# Vivado block design bd_48ac, xczu19eg-ffvc1760-2-i, Vivado 2021.1
# (continued, part 2 of 4)
current_bd_instance /s01_nodes

# ---- hierarchy /m00_nodes ----
current_bd_instance /m00_nodes
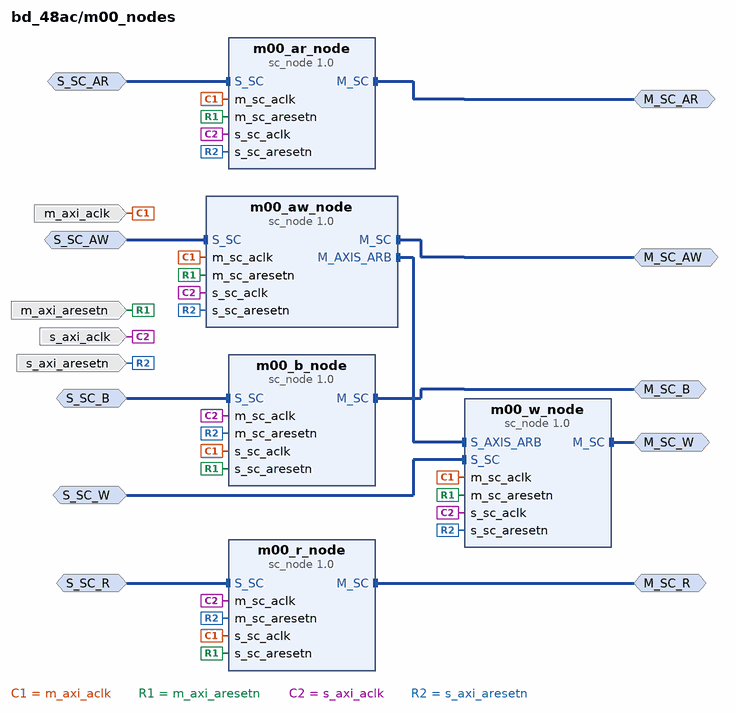
[diagram p7: block diagram inside /m00_nodes]
create_bd_intf_pin -mode Master -vlnv xilinx.com:interface:sc_rtl:1.0 M_SC_AR
create_bd_intf_pin -mode Slave -vlnv xilinx.com:interface:sc_rtl:1.0 S_SC_AR
create_bd_intf_pin -mode Master -vlnv xilinx.com:interface:sc_rtl:1.0 M_SC_R
create_bd_intf_pin -mode Slave -vlnv xilinx.com:interface:sc_rtl:1.0 S_SC_R
create_bd_intf_pin -mode Master -vlnv xilinx.com:interface:sc_rtl:1.0 M_SC_AW
create_bd_intf_pin -mode Slave -vlnv xilinx.com:interface:sc_rtl:1.0 S_SC_AW
create_bd_intf_pin -mode Master -vlnv xilinx.com:interface:sc_rtl:1.0 M_SC_W
create_bd_intf_pin -mode Slave -vlnv xilinx.com:interface:sc_rtl:1.0 S_SC_W
create_bd_intf_pin -mode Master -vlnv xilinx.com:interface:sc_rtl:1.0 M_SC_B
create_bd_intf_pin -mode Slave -vlnv xilinx.com:interface:sc_rtl:1.0 S_SC_B
create_bd_pin -dir I -type clk s_axi_aclk
create_bd_pin -dir I -type rst s_axi_aresetn
create_bd_pin -dir I -type clk m_axi_aclk
create_bd_pin -dir I -type rst m_axi_aresetn

create_bd_cell -type ip -vlnv xilinx.com:ip:sc_node:1.0 m00_ar_node
set_property -dict [list \
  CONFIG.ACLK_RELATIONSHIP 1 \
  CONFIG.ADDR_WIDTH 64 \
  CONFIG.CHANNEL 2 \
  CONFIG.ID_WIDTH 2 \
  CONFIG.M00_NUM_BYTES 64 \
  CONFIG.M01_NUM_BYTES 64 \
  CONFIG.M02_NUM_BYTES 64 \
  CONFIG.M03_NUM_BYTES 64 \
  CONFIG.M04_NUM_BYTES 64 \
  CONFIG.M05_NUM_BYTES 64 \
  CONFIG.M06_NUM_BYTES 64 \
  CONFIG.M07_NUM_BYTES 64 \
  CONFIG.M08_NUM_BYTES 64 \
  CONFIG.M09_NUM_BYTES 64 \
  CONFIG.M10_NUM_BYTES 64 \
  CONFIG.M11_NUM_BYTES 64 \
  CONFIG.M12_NUM_BYTES 64 \
  CONFIG.M13_NUM_BYTES 64 \
  CONFIG.M14_NUM_BYTES 64 \
  CONFIG.M15_NUM_BYTES 64 \
  CONFIG.MAX_PAYLD_BYTES 64 \
  CONFIG.M_SEND_PIPELINE 0 \
  CONFIG.NUM_MI 1 \
  CONFIG.NUM_OUTSTANDING 8 \
  CONFIG.NUM_SI 2 \
  CONFIG.PAYLD_WIDTH 178 \
  CONFIG.S00_NUM_BYTES 64 \
  CONFIG.S01_NUM_BYTES 64 \
  CONFIG.S02_NUM_BYTES 64 \
  CONFIG.S03_NUM_BYTES 64 \
  CONFIG.S04_NUM_BYTES 64 \
  CONFIG.S05_NUM_BYTES 64 \
  CONFIG.S06_NUM_BYTES 64 \
  CONFIG.S07_NUM_BYTES 64 \
  CONFIG.S08_NUM_BYTES 64 \
  CONFIG.S09_NUM_BYTES 64 \
  CONFIG.S10_NUM_BYTES 64 \
  CONFIG.S11_NUM_BYTES 64 \
  CONFIG.S12_NUM_BYTES 64 \
  CONFIG.S13_NUM_BYTES 64 \
  CONFIG.S14_NUM_BYTES 64 \
  CONFIG.S15_NUM_BYTES 64 \
  CONFIG.SC_ROUTE_WIDTH 7 \
  CONFIG.S_LATENCY 1 \
  CONFIG.USER_WIDTH 0 \
] [get_bd_cells m00_ar_node]
create_bd_cell -type ip -vlnv xilinx.com:ip:sc_node:1.0 m00_r_node
set_property -dict [list \
  CONFIG.ACLK_RELATIONSHIP 1 \
  CONFIG.ADDR_WIDTH 64 \
  CONFIG.CHANNEL 0 \
  CONFIG.ID_WIDTH 2 \
  CONFIG.M00_NUM_BYTES 64 \
  CONFIG.M01_NUM_BYTES 64 \
  CONFIG.M02_NUM_BYTES 64 \
  CONFIG.M03_NUM_BYTES 64 \
  CONFIG.M04_NUM_BYTES 64 \
  CONFIG.M05_NUM_BYTES 64 \
  CONFIG.M06_NUM_BYTES 64 \
  CONFIG.M07_NUM_BYTES 64 \
  CONFIG.M08_NUM_BYTES 64 \
  CONFIG.M09_NUM_BYTES 64 \
  CONFIG.M10_NUM_BYTES 64 \
  CONFIG.M11_NUM_BYTES 64 \
  CONFIG.M12_NUM_BYTES 64 \
  CONFIG.M13_NUM_BYTES 64 \
  CONFIG.M14_NUM_BYTES 64 \
  CONFIG.M15_NUM_BYTES 64 \
  CONFIG.MAX_PAYLD_BYTES 64 \
  CONFIG.M_PIPELINE 0 \
  CONFIG.NUM_MI 2 \
  CONFIG.NUM_OUTSTANDING 8 \
  CONFIG.NUM_SI 1 \
  CONFIG.PAYLD_WIDTH 533 \
  CONFIG.S00_NUM_BYTES 64 \
  CONFIG.S01_NUM_BYTES 64 \
  CONFIG.S02_NUM_BYTES 64 \
  CONFIG.S03_NUM_BYTES 64 \
  CONFIG.S04_NUM_BYTES 64 \
  CONFIG.S05_NUM_BYTES 64 \
  CONFIG.S06_NUM_BYTES 64 \
  CONFIG.S07_NUM_BYTES 64 \
  CONFIG.S08_NUM_BYTES 64 \
  CONFIG.S09_NUM_BYTES 64 \
  CONFIG.S10_NUM_BYTES 64 \
  CONFIG.S11_NUM_BYTES 64 \
  CONFIG.S12_NUM_BYTES 64 \
  CONFIG.S13_NUM_BYTES 64 \
  CONFIG.S14_NUM_BYTES 64 \
  CONFIG.S15_NUM_BYTES 64 \
  CONFIG.SC_ROUTE_WIDTH 2 \
  CONFIG.USER_BITS_PER_BYTE 0 \
  CONFIG.USER_WIDTH 0 \
] [get_bd_cells m00_r_node]
create_bd_cell -type ip -vlnv xilinx.com:ip:sc_node:1.0 m00_aw_node
set_property -dict [list \
  CONFIG.ACLK_RELATIONSHIP 1 \
  CONFIG.ADDR_WIDTH 64 \
  CONFIG.CHANNEL 3 \
  CONFIG.ID_WIDTH 2 \
  CONFIG.M00_NUM_BYTES 64 \
  CONFIG.M01_NUM_BYTES 64 \
  CONFIG.M02_NUM_BYTES 64 \
  CONFIG.M03_NUM_BYTES 64 \
  CONFIG.M04_NUM_BYTES 64 \
  CONFIG.M05_NUM_BYTES 64 \
  CONFIG.M06_NUM_BYTES 64 \
  CONFIG.M07_NUM_BYTES 64 \
  CONFIG.M08_NUM_BYTES 64 \
  CONFIG.M09_NUM_BYTES 64 \
  CONFIG.M10_NUM_BYTES 64 \
  CONFIG.M11_NUM_BYTES 64 \
  CONFIG.M12_NUM_BYTES 64 \
  CONFIG.M13_NUM_BYTES 64 \
  CONFIG.M14_NUM_BYTES 64 \
  CONFIG.M15_NUM_BYTES 64 \
  CONFIG.MAX_PAYLD_BYTES 64 \
  CONFIG.M_SEND_PIPELINE 0 \
  CONFIG.NUM_MI 1 \
  CONFIG.NUM_OUTSTANDING 32 \
  CONFIG.NUM_SI 2 \
  CONFIG.PAYLD_WIDTH 178 \
  CONFIG.S00_NUM_BYTES 64 \
  CONFIG.S01_NUM_BYTES 64 \
  CONFIG.S02_NUM_BYTES 64 \
  CONFIG.S03_NUM_BYTES 64 \
  CONFIG.S04_NUM_BYTES 64 \
  CONFIG.S05_NUM_BYTES 64 \
  CONFIG.S06_NUM_BYTES 64 \
  CONFIG.S07_NUM_BYTES 64 \
  CONFIG.S08_NUM_BYTES 64 \
  CONFIG.S09_NUM_BYTES 64 \
  CONFIG.S10_NUM_BYTES 64 \
  CONFIG.S11_NUM_BYTES 64 \
  CONFIG.S12_NUM_BYTES 64 \
  CONFIG.S13_NUM_BYTES 64 \
  CONFIG.S14_NUM_BYTES 64 \
  CONFIG.S15_NUM_BYTES 64 \
  CONFIG.SC_ROUTE_WIDTH 7 \
  CONFIG.S_LATENCY 1 \
  CONFIG.USER_WIDTH 0 \
] [get_bd_cells m00_aw_node]
create_bd_cell -type ip -vlnv xilinx.com:ip:sc_node:1.0 m00_w_node
set_property -dict [list \
  CONFIG.ACLK_RELATIONSHIP 1 \
  CONFIG.ADDR_WIDTH 64 \
  CONFIG.CHANNEL 1 \
  CONFIG.ID_WIDTH 2 \
  CONFIG.M00_NUM_BYTES 64 \
  CONFIG.M01_NUM_BYTES 64 \
  CONFIG.M02_NUM_BYTES 64 \
  CONFIG.M03_NUM_BYTES 64 \
  CONFIG.M04_NUM_BYTES 64 \
  CONFIG.M05_NUM_BYTES 64 \
  CONFIG.M06_NUM_BYTES 64 \
  CONFIG.M07_NUM_BYTES 64 \
  CONFIG.M08_NUM_BYTES 64 \
  CONFIG.M09_NUM_BYTES 64 \
  CONFIG.M10_NUM_BYTES 64 \
  CONFIG.M11_NUM_BYTES 64 \
  CONFIG.M12_NUM_BYTES 64 \
  CONFIG.M13_NUM_BYTES 64 \
  CONFIG.M14_NUM_BYTES 64 \
  CONFIG.M15_NUM_BYTES 64 \
  CONFIG.MAX_PAYLD_BYTES 64 \
  CONFIG.M_SEND_PIPELINE 0 \
  CONFIG.NUM_MI 1 \
  CONFIG.NUM_OUTSTANDING 32 \
  CONFIG.NUM_SI 2 \
  CONFIG.PAYLD_WIDTH 598 \
  CONFIG.S00_NUM_BYTES 64 \
  CONFIG.S01_NUM_BYTES 64 \
  CONFIG.S02_NUM_BYTES 64 \
  CONFIG.S03_NUM_BYTES 64 \
  CONFIG.S04_NUM_BYTES 64 \
  CONFIG.S05_NUM_BYTES 64 \
  CONFIG.S06_NUM_BYTES 64 \
  CONFIG.S07_NUM_BYTES 64 \
  CONFIG.S08_NUM_BYTES 64 \
  CONFIG.S09_NUM_BYTES 64 \
  CONFIG.S10_NUM_BYTES 64 \
  CONFIG.S11_NUM_BYTES 64 \
  CONFIG.S12_NUM_BYTES 64 \
  CONFIG.S13_NUM_BYTES 64 \
  CONFIG.S14_NUM_BYTES 64 \
  CONFIG.S15_NUM_BYTES 64 \
  CONFIG.SC_ROUTE_WIDTH 7 \
  CONFIG.S_LATENCY 1 \
  CONFIG.USER_BITS_PER_BYTE 0 \
  CONFIG.USER_WIDTH 0 \
] [get_bd_cells m00_w_node]
create_bd_cell -type ip -vlnv xilinx.com:ip:sc_node:1.0 m00_b_node
set_property -dict [list \
  CONFIG.ACLK_RELATIONSHIP 1 \
  CONFIG.ADDR_WIDTH 64 \
  CONFIG.CHANNEL 4 \
  CONFIG.ID_WIDTH 2 \
  CONFIG.M00_NUM_BYTES 64 \
  CONFIG.M01_NUM_BYTES 64 \
  CONFIG.M02_NUM_BYTES 64 \
  CONFIG.M03_NUM_BYTES 64 \
  CONFIG.M04_NUM_BYTES 64 \
  CONFIG.M05_NUM_BYTES 64 \
  CONFIG.M06_NUM_BYTES 64 \
  CONFIG.M07_NUM_BYTES 64 \
  CONFIG.M08_NUM_BYTES 64 \
  CONFIG.M09_NUM_BYTES 64 \
  CONFIG.M10_NUM_BYTES 64 \
  CONFIG.M11_NUM_BYTES 64 \
  CONFIG.M12_NUM_BYTES 64 \
  CONFIG.M13_NUM_BYTES 64 \
  CONFIG.M14_NUM_BYTES 64 \
  CONFIG.M15_NUM_BYTES 64 \
  CONFIG.MAX_PAYLD_BYTES 64 \
  CONFIG.M_PIPELINE 0 \
  CONFIG.NUM_MI 2 \
  CONFIG.NUM_OUTSTANDING 32 \
  CONFIG.NUM_SI 1 \
  CONFIG.PAYLD_WIDTH 7 \
  CONFIG.S00_NUM_BYTES 64 \
  CONFIG.S01_NUM_BYTES 64 \
  CONFIG.S02_NUM_BYTES 64 \
  CONFIG.S03_NUM_BYTES 64 \
  CONFIG.S04_NUM_BYTES 64 \
  CONFIG.S05_NUM_BYTES 64 \
  CONFIG.S06_NUM_BYTES 64 \
  CONFIG.S07_NUM_BYTES 64 \
  CONFIG.S08_NUM_BYTES 64 \
  CONFIG.S09_NUM_BYTES 64 \
  CONFIG.S10_NUM_BYTES 64 \
  CONFIG.S11_NUM_BYTES 64 \
  CONFIG.S12_NUM_BYTES 64 \
  CONFIG.S13_NUM_BYTES 64 \
  CONFIG.S14_NUM_BYTES 64 \
  CONFIG.S15_NUM_BYTES 64 \
  CONFIG.SC_ROUTE_WIDTH 2 \
  CONFIG.USER_WIDTH 0 \
] [get_bd_cells m00_b_node]

# ---- hierarchy /m00_exit_pipeline ----
current_bd_instance /m00_exit_pipeline
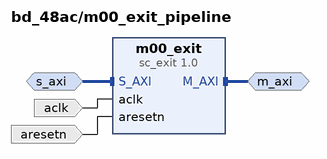
[diagram p8: block diagram inside /m00_exit_pipeline]
create_bd_intf_pin -mode Slave -vlnv xilinx.com:interface:aximm_rtl:1.0 s_axi
create_bd_intf_pin -mode Master -vlnv xilinx.com:interface:aximm_rtl:1.0 m_axi
create_bd_pin -dir I -type clk aclk
create_bd_pin -dir I -type rst aresetn

create_bd_cell -type ip -vlnv xilinx.com:ip:sc_exit:1.0 m00_exit
set_property -dict [list \
  CONFIG.ADDR_WIDTH 34 \
  CONFIG.HAS_BURST 1 \
  CONFIG.HAS_LOCK 0 \
  CONFIG.IS_CASCADED 0 \
  CONFIG.MAX_RUSER_BITS_PER_BYTE 0 \
  CONFIG.MAX_WUSER_BITS_PER_BYTE 0 \
  CONFIG.MEP_IDENTIFIER_WIDTH 2 \
  CONFIG.M_ARUSER_WIDTH 0 \
  CONFIG.M_AWUSER_WIDTH 0 \
  CONFIG.M_BUSER_WIDTH 0 \
  CONFIG.M_ID_WIDTH 0 \
  CONFIG.M_MAX_BURST_LENGTH 256 \
  CONFIG.M_PROTOCOL AXI4 \
  CONFIG.M_RUSER_BITS_PER_BYTE 0 \
  CONFIG.M_RUSER_WIDTH 0 \
  CONFIG.M_WUSER_BITS_PER_BYTE 0 \
  CONFIG.M_WUSER_WIDTH 0 \
  CONFIG.NUM_MSC 7 \
  CONFIG.NUM_READ_OUTSTANDING 8 \
  CONFIG.NUM_WRITE_OUTSTANDING 32 \
  CONFIG.RDATA_WIDTH 512 \
  CONFIG.READ_WRITE_MODE READ_WRITE \
  CONFIG.SSC000_ROUTE 0b00 \
  CONFIG.SSC001_ROUTE 0b01 \
  CONFIG.SSC002_ROUTE 0b10 \
  CONFIG.SSC003_ROUTE 0b00 \
  CONFIG.SSC_ROUTE_WIDTH 2 \
  CONFIG.S_ID_WIDTH 2 \
  CONFIG.WDATA_WIDTH 512 \
] [get_bd_cells m00_exit]

# ---- hierarchy /m01_nodes ----
current_bd_instance /m01_nodes
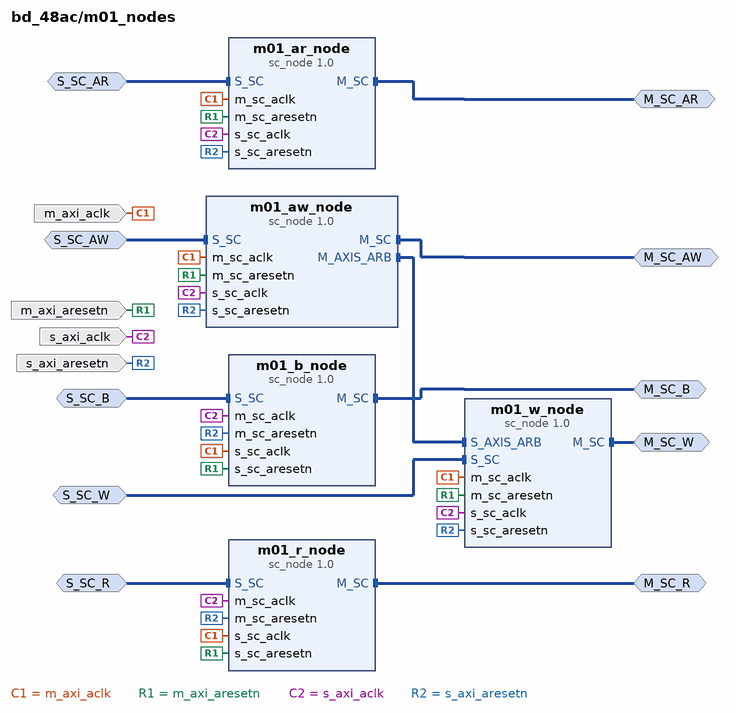
[diagram p9: block diagram inside /m01_nodes]
create_bd_intf_pin -mode Master -vlnv xilinx.com:interface:sc_rtl:1.0 M_SC_AR
create_bd_intf_pin -mode Slave -vlnv xilinx.com:interface:sc_rtl:1.0 S_SC_AR
create_bd_intf_pin -mode Master -vlnv xilinx.com:interface:sc_rtl:1.0 M_SC_R
create_bd_intf_pin -mode Slave -vlnv xilinx.com:interface:sc_rtl:1.0 S_SC_R
create_bd_intf_pin -mode Master -vlnv xilinx.com:interface:sc_rtl:1.0 M_SC_AW
create_bd_intf_pin -mode Slave -vlnv xilinx.com:interface:sc_rtl:1.0 S_SC_AW
create_bd_intf_pin -mode Master -vlnv xilinx.com:interface:sc_rtl:1.0 M_SC_W
create_bd_intf_pin -mode Slave -vlnv xilinx.com:interface:sc_rtl:1.0 S_SC_W
create_bd_intf_pin -mode Master -vlnv xilinx.com:interface:sc_rtl:1.0 M_SC_B
create_bd_intf_pin -mode Slave -vlnv xilinx.com:interface:sc_rtl:1.0 S_SC_B
create_bd_pin -dir I -type clk s_axi_aclk
create_bd_pin -dir I -type rst s_axi_aresetn
create_bd_pin -dir I -type clk m_axi_aclk
create_bd_pin -dir I -type rst m_axi_aresetn

create_bd_cell -type ip -vlnv xilinx.com:ip:sc_node:1.0 m01_ar_node
set_property -dict [list \
  CONFIG.ACLK_RELATIONSHIP 1 \
  CONFIG.ADDR_WIDTH 64 \
  CONFIG.CHANNEL 2 \
  CONFIG.ID_WIDTH 2 \
  CONFIG.M00_NUM_BYTES 4 \
  CONFIG.M01_NUM_BYTES 4 \
  CONFIG.M02_NUM_BYTES 4 \
  CONFIG.M03_NUM_BYTES 4 \
  CONFIG.M04_NUM_BYTES 4 \
  CONFIG.M05_NUM_BYTES 4 \
  CONFIG.M06_NUM_BYTES 4 \
  CONFIG.M07_NUM_BYTES 4 \
  CONFIG.M08_NUM_BYTES 4 \
  CONFIG.M09_NUM_BYTES 4 \
  CONFIG.M10_NUM_BYTES 4 \
  CONFIG.M11_NUM_BYTES 4 \
  CONFIG.M12_NUM_BYTES 4 \
  CONFIG.M13_NUM_BYTES 4 \
  CONFIG.M14_NUM_BYTES 4 \
  CONFIG.M15_NUM_BYTES 4 \
  CONFIG.MAX_PAYLD_BYTES 64 \
  CONFIG.M_SEND_PIPELINE 0 \
  CONFIG.NUM_MI 1 \
  CONFIG.NUM_OUTSTANDING 8 \
  CONFIG.NUM_SI 2 \
  CONFIG.PAYLD_WIDTH 178 \
  CONFIG.S00_NUM_BYTES 64 \
  CONFIG.S01_NUM_BYTES 64 \
  CONFIG.S02_NUM_BYTES 64 \
  CONFIG.S03_NUM_BYTES 64 \
  CONFIG.S04_NUM_BYTES 64 \
  CONFIG.S05_NUM_BYTES 64 \
  CONFIG.S06_NUM_BYTES 64 \
  CONFIG.S07_NUM_BYTES 64 \
  CONFIG.S08_NUM_BYTES 64 \
  CONFIG.S09_NUM_BYTES 64 \
  CONFIG.S10_NUM_BYTES 64 \
  CONFIG.S11_NUM_BYTES 64 \
  CONFIG.S12_NUM_BYTES 64 \
  CONFIG.S13_NUM_BYTES 64 \
  CONFIG.S14_NUM_BYTES 64 \
  CONFIG.S15_NUM_BYTES 64 \
  CONFIG.SC_ROUTE_WIDTH 7 \
  CONFIG.S_LATENCY 1 \
  CONFIG.USER_WIDTH 0 \
] [get_bd_cells m01_ar_node]
create_bd_cell -type ip -vlnv xilinx.com:ip:sc_node:1.0 m01_r_node
set_property -dict [list \
  CONFIG.ACLK_RELATIONSHIP 1 \
  CONFIG.ADDR_WIDTH 64 \
  CONFIG.CHANNEL 0 \
  CONFIG.ID_WIDTH 2 \
  CONFIG.M00_NUM_BYTES 64 \
  CONFIG.M01_NUM_BYTES 64 \
  CONFIG.M02_NUM_BYTES 64 \
  CONFIG.M03_NUM_BYTES 64 \
  CONFIG.M04_NUM_BYTES 64 \
  CONFIG.M05_NUM_BYTES 64 \
  CONFIG.M06_NUM_BYTES 64 \
  CONFIG.M07_NUM_BYTES 64 \
  CONFIG.M08_NUM_BYTES 64 \
  CONFIG.M09_NUM_BYTES 64 \
  CONFIG.M10_NUM_BYTES 64 \
  CONFIG.M11_NUM_BYTES 64 \
  CONFIG.M12_NUM_BYTES 64 \
  CONFIG.M13_NUM_BYTES 64 \
  CONFIG.M14_NUM_BYTES 64 \
  CONFIG.M15_NUM_BYTES 64 \
  CONFIG.MAX_PAYLD_BYTES 64 \
  CONFIG.M_PIPELINE 0 \
  CONFIG.NUM_MI 2 \
  CONFIG.NUM_OUTSTANDING 8 \
  CONFIG.NUM_SI 1 \
  CONFIG.PAYLD_WIDTH 533 \
  CONFIG.S00_NUM_BYTES 4 \
  CONFIG.S01_NUM_BYTES 4 \
  CONFIG.S02_NUM_BYTES 4 \
  CONFIG.S03_NUM_BYTES 4 \
  CONFIG.S04_NUM_BYTES 4 \
  CONFIG.S05_NUM_BYTES 4 \
  CONFIG.S06_NUM_BYTES 4 \
  CONFIG.S07_NUM_BYTES 4 \
  CONFIG.S08_NUM_BYTES 4 \
  CONFIG.S09_NUM_BYTES 4 \
  CONFIG.S10_NUM_BYTES 4 \
  CONFIG.S11_NUM_BYTES 4 \
  CONFIG.S12_NUM_BYTES 4 \
  CONFIG.S13_NUM_BYTES 4 \
  CONFIG.S14_NUM_BYTES 4 \
  CONFIG.S15_NUM_BYTES 4 \
  CONFIG.SC_ROUTE_WIDTH 2 \
  CONFIG.USER_BITS_PER_BYTE 0 \
  CONFIG.USER_WIDTH 0 \
] [get_bd_cells m01_r_node]
create_bd_cell -type ip -vlnv xilinx.com:ip:sc_node:1.0 m01_aw_node
set_property -dict [list \
  CONFIG.ACLK_RELATIONSHIP 1 \
  CONFIG.ADDR_WIDTH 64 \
  CONFIG.CHANNEL 3 \
  CONFIG.ID_WIDTH 2 \
  CONFIG.M00_NUM_BYTES 4 \
  CONFIG.M01_NUM_BYTES 4 \
  CONFIG.M02_NUM_BYTES 4 \
  CONFIG.M03_NUM_BYTES 4 \
  CONFIG.M04_NUM_BYTES 4 \
  CONFIG.M05_NUM_BYTES 4 \
  CONFIG.M06_NUM_BYTES 4 \
  CONFIG.M07_NUM_BYTES 4 \
  CONFIG.M08_NUM_BYTES 4 \
  CONFIG.M09_NUM_BYTES 4 \
  CONFIG.M10_NUM_BYTES 4 \
  CONFIG.M11_NUM_BYTES 4 \
  CONFIG.M12_NUM_BYTES 4 \
  CONFIG.M13_NUM_BYTES 4 \
  CONFIG.M14_NUM_BYTES 4 \
  CONFIG.M15_NUM_BYTES 4 \
  CONFIG.MAX_PAYLD_BYTES 64 \
  CONFIG.M_SEND_PIPELINE 0 \
  CONFIG.NUM_MI 1 \
  CONFIG.NUM_OUTSTANDING 32 \
  CONFIG.NUM_SI 2 \
  CONFIG.PAYLD_WIDTH 178 \
  CONFIG.S00_NUM_BYTES 64 \
  CONFIG.S01_NUM_BYTES 64 \
  CONFIG.S02_NUM_BYTES 64 \
  CONFIG.S03_NUM_BYTES 64 \
  CONFIG.S04_NUM_BYTES 64 \
  CONFIG.S05_NUM_BYTES 64 \
  CONFIG.S06_NUM_BYTES 64 \
  CONFIG.S07_NUM_BYTES 64 \
  CONFIG.S08_NUM_BYTES 64 \
  CONFIG.S09_NUM_BYTES 64 \
  CONFIG.S10_NUM_BYTES 64 \
  CONFIG.S11_NUM_BYTES 64 \
  CONFIG.S12_NUM_BYTES 64 \
  CONFIG.S13_NUM_BYTES 64 \
  CONFIG.S14_NUM_BYTES 64 \
  CONFIG.S15_NUM_BYTES 64 \
  CONFIG.SC_ROUTE_WIDTH 7 \
  CONFIG.S_LATENCY 1 \
  CONFIG.USER_WIDTH 0 \
] [get_bd_cells m01_aw_node]
create_bd_cell -type ip -vlnv xilinx.com:ip:sc_node:1.0 m01_w_node
set_property -dict [list \
  CONFIG.ACLK_RELATIONSHIP 1 \
  CONFIG.ADDR_WIDTH 64 \
  CONFIG.CHANNEL 1 \
  CONFIG.ID_WIDTH 2 \
  CONFIG.M00_NUM_BYTES 4 \
  CONFIG.M01_NUM_BYTES 4 \
  CONFIG.M02_NUM_BYTES 4 \
  CONFIG.M03_NUM_BYTES 4 \
  CONFIG.M04_NUM_BYTES 4 \
  CONFIG.M05_NUM_BYTES 4 \
  CONFIG.M06_NUM_BYTES 4 \
  CONFIG.M07_NUM_BYTES 4 \
  CONFIG.M08_NUM_BYTES 4 \
  CONFIG.M09_NUM_BYTES 4 \
  CONFIG.M10_NUM_BYTES 4 \
  CONFIG.M11_NUM_BYTES 4 \
  CONFIG.M12_NUM_BYTES 4 \
  CONFIG.M13_NUM_BYTES 4 \
  CONFIG.M14_NUM_BYTES 4 \
  CONFIG.M15_NUM_BYTES 4 \
  CONFIG.MAX_PAYLD_BYTES 64 \
  CONFIG.M_SEND_PIPELINE 0 \
  CONFIG.NUM_MI 1 \
  CONFIG.NUM_OUTSTANDING 32 \
  CONFIG.NUM_SI 2 \
  CONFIG.PAYLD_WIDTH 598 \
  CONFIG.S00_NUM_BYTES 64 \
  CONFIG.S01_NUM_BYTES 64 \
  CONFIG.S02_NUM_BYTES 64 \
  CONFIG.S03_NUM_BYTES 64 \
  CONFIG.S04_NUM_BYTES 64 \
  CONFIG.S05_NUM_BYTES 64 \
  CONFIG.S06_NUM_BYTES 64 \
  CONFIG.S07_NUM_BYTES 64 \
  CONFIG.S08_NUM_BYTES 64 \
  CONFIG.S09_NUM_BYTES 64 \
  CONFIG.S10_NUM_BYTES 64 \
  CONFIG.S11_NUM_BYTES 64 \
  CONFIG.S12_NUM_BYTES 64 \
  CONFIG.S13_NUM_BYTES 64 \
  CONFIG.S14_NUM_BYTES 64 \
  CONFIG.S15_NUM_BYTES 64 \
  CONFIG.SC_ROUTE_WIDTH 7 \
  CONFIG.S_LATENCY 1 \
  CONFIG.USER_BITS_PER_BYTE 0 \
  CONFIG.USER_WIDTH 0 \
] [get_bd_cells m01_w_node]
create_bd_cell -type ip -vlnv xilinx.com:ip:sc_node:1.0 m01_b_node
set_property -dict [list \
  CONFIG.ACLK_RELATIONSHIP 1 \
  CONFIG.ADDR_WIDTH 64 \
  CONFIG.CHANNEL 4 \
  CONFIG.ID_WIDTH 2 \
  CONFIG.M00_NUM_BYTES 64 \
  CONFIG.M01_NUM_BYTES 64 \
  CONFIG.M02_NUM_BYTES 64 \
  CONFIG.M03_NUM_BYTES 64 \
  CONFIG.M04_NUM_BYTES 64 \
  CONFIG.M05_NUM_BYTES 64 \
  CONFIG.M06_NUM_BYTES 64 \
  CONFIG.M07_NUM_BYTES 64 \
  CONFIG.M08_NUM_BYTES 64 \
  CONFIG.M09_NUM_BYTES 64 \
  CONFIG.M10_NUM_BYTES 64 \
  CONFIG.M11_NUM_BYTES 64 \
  CONFIG.M12_NUM_BYTES 64 \
  CONFIG.M13_NUM_BYTES 64 \
  CONFIG.M14_NUM_BYTES 64 \
  CONFIG.M15_NUM_BYTES 64 \
  CONFIG.MAX_PAYLD_BYTES 64 \
  CONFIG.M_PIPELINE 0 \
  CONFIG.NUM_MI 2 \
  CONFIG.NUM_OUTSTANDING 32 \
  CONFIG.NUM_SI 1 \
  CONFIG.PAYLD_WIDTH 7 \
  CONFIG.S00_NUM_BYTES 4 \
  CONFIG.S01_NUM_BYTES 4 \
  CONFIG.S02_NUM_BYTES 4 \
  CONFIG.S03_NUM_BYTES 4 \
  CONFIG.S04_NUM_BYTES 4 \
  CONFIG.S05_NUM_BYTES 4 \
  CONFIG.S06_NUM_BYTES 4 \
  CONFIG.S07_NUM_BYTES 4 \
  CONFIG.S08_NUM_BYTES 4 \
  CONFIG.S09_NUM_BYTES 4 \
  CONFIG.S10_NUM_BYTES 4 \
  CONFIG.S11_NUM_BYTES 4 \
  CONFIG.S12_NUM_BYTES 4 \
  CONFIG.S13_NUM_BYTES 4 \
  CONFIG.S14_NUM_BYTES 4 \
  CONFIG.S15_NUM_BYTES 4 \
  CONFIG.SC_ROUTE_WIDTH 2 \
  CONFIG.USER_WIDTH 0 \
] [get_bd_cells m01_b_node]

# ---- hierarchy /m01_exit_pipeline ----
current_bd_instance /m01_exit_pipeline
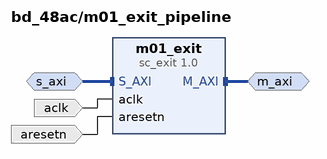
[diagram p10: block diagram inside /m01_exit_pipeline]
create_bd_intf_pin -mode Slave -vlnv xilinx.com:interface:aximm_rtl:1.0 s_axi
create_bd_intf_pin -mode Master -vlnv xilinx.com:interface:aximm_rtl:1.0 m_axi
create_bd_pin -dir I -type clk aclk
create_bd_pin -dir I -type rst aresetn

create_bd_cell -type ip -vlnv xilinx.com:ip:sc_exit:1.0 m01_exit
set_property -dict [list \
  CONFIG.ADDR_WIDTH 32 \
  CONFIG.HAS_BURST 0 \
  CONFIG.IS_CASCADED 0 \
  CONFIG.MEP_IDENTIFIER_WIDTH 2 \
  CONFIG.M_MAX_BURST_LENGTH 1 \
  CONFIG.M_PROTOCOL AXI4LITE \
  CONFIG.NUM_MSC 7 \
  CONFIG.NUM_READ_OUTSTANDING 8 \
  CONFIG.NUM_WRITE_OUTSTANDING 32 \
  CONFIG.RDATA_WIDTH 32 \
  CONFIG.READ_WRITE_MODE READ_WRITE \
  CONFIG.SSC000_ROUTE 0b00 \
  CONFIG.SSC001_ROUTE 0b01 \
  CONFIG.SSC002_ROUTE 0b10 \
  CONFIG.SSC003_ROUTE 0b00 \
  CONFIG.SSC_ROUTE_WIDTH 2 \
  CONFIG.S_ID_WIDTH 2 \
  CONFIG.WDATA_WIDTH 32 \
] [get_bd_cells m01_exit]

# ---- hierarchy /m02_nodes ----
current_bd_instance /m02_nodes
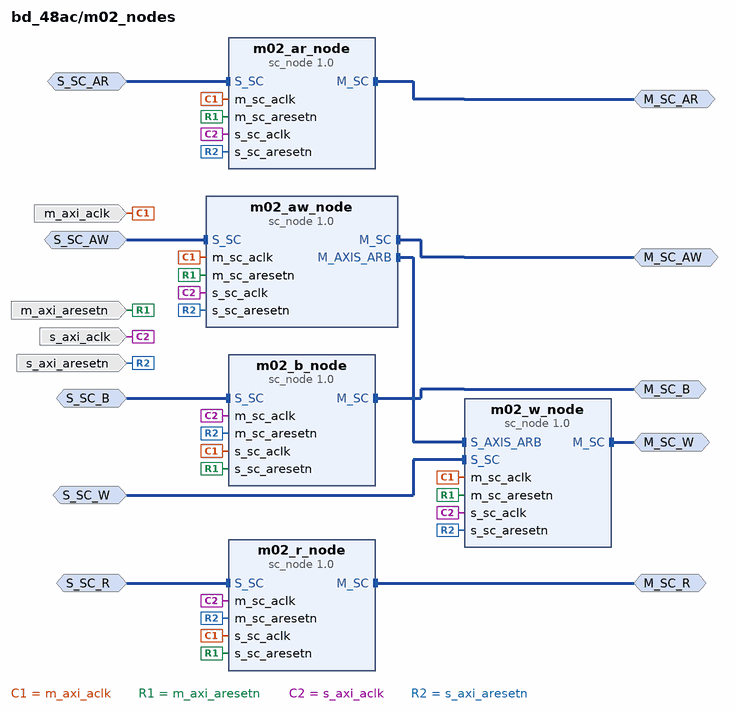
[diagram p11: block diagram inside /m02_nodes]
create_bd_intf_pin -mode Master -vlnv xilinx.com:interface:sc_rtl:1.0 M_SC_AR
create_bd_intf_pin -mode Slave -vlnv xilinx.com:interface:sc_rtl:1.0 S_SC_AR
create_bd_intf_pin -mode Master -vlnv xilinx.com:interface:sc_rtl:1.0 M_SC_R
create_bd_intf_pin -mode Slave -vlnv xilinx.com:interface:sc_rtl:1.0 S_SC_R
create_bd_intf_pin -mode Master -vlnv xilinx.com:interface:sc_rtl:1.0 M_SC_AW
create_bd_intf_pin -mode Slave -vlnv xilinx.com:interface:sc_rtl:1.0 S_SC_AW
create_bd_intf_pin -mode Master -vlnv xilinx.com:interface:sc_rtl:1.0 M_SC_W
create_bd_intf_pin -mode Slave -vlnv xilinx.com:interface:sc_rtl:1.0 S_SC_W
create_bd_intf_pin -mode Master -vlnv xilinx.com:interface:sc_rtl:1.0 M_SC_B
create_bd_intf_pin -mode Slave -vlnv xilinx.com:interface:sc_rtl:1.0 S_SC_B
create_bd_pin -dir I -type clk s_axi_aclk
create_bd_pin -dir I -type rst s_axi_aresetn
create_bd_pin -dir I -type clk m_axi_aclk
create_bd_pin -dir I -type rst m_axi_aresetn

create_bd_cell -type ip -vlnv xilinx.com:ip:sc_node:1.0 m02_ar_node
set_property -dict [list \
  CONFIG.ACLK_RELATIONSHIP 0 \
  CONFIG.ADDR_WIDTH 64 \
  CONFIG.CHANNEL 2 \
  CONFIG.ID_WIDTH 2 \
  CONFIG.M00_NUM_BYTES 4 \
  CONFIG.M01_NUM_BYTES 4 \
  CONFIG.M02_NUM_BYTES 4 \
  CONFIG.M03_NUM_BYTES 4 \
  CONFIG.M04_NUM_BYTES 4 \
  CONFIG.M05_NUM_BYTES 4 \
  CONFIG.M06_NUM_BYTES 4 \
  CONFIG.M07_NUM_BYTES 4 \
  CONFIG.M08_NUM_BYTES 4 \
  CONFIG.M09_NUM_BYTES 4 \
  CONFIG.M10_NUM_BYTES 4 \
  CONFIG.M11_NUM_BYTES 4 \
  CONFIG.M12_NUM_BYTES 4 \
  CONFIG.M13_NUM_BYTES 4 \
  CONFIG.M14_NUM_BYTES 4 \
  CONFIG.M15_NUM_BYTES 4 \
  CONFIG.MAX_PAYLD_BYTES 64 \
  CONFIG.M_SEND_PIPELINE 0 \
  CONFIG.NUM_MI 1 \
  CONFIG.NUM_OUTSTANDING 8 \
  CONFIG.NUM_SI 2 \
  CONFIG.PAYLD_WIDTH 178 \
  CONFIG.S00_NUM_BYTES 64 \
  CONFIG.S01_NUM_BYTES 64 \
  CONFIG.S02_NUM_BYTES 64 \
  CONFIG.S03_NUM_BYTES 64 \
  CONFIG.S04_NUM_BYTES 64 \
  CONFIG.S05_NUM_BYTES 64 \
  CONFIG.S06_NUM_BYTES 64 \
  CONFIG.S07_NUM_BYTES 64 \
  CONFIG.S08_NUM_BYTES 64 \
  CONFIG.S09_NUM_BYTES 64 \
  CONFIG.S10_NUM_BYTES 64 \
  CONFIG.S11_NUM_BYTES 64 \
  CONFIG.S12_NUM_BYTES 64 \
  CONFIG.S13_NUM_BYTES 64 \
  CONFIG.S14_NUM_BYTES 64 \
  CONFIG.S15_NUM_BYTES 64 \
  CONFIG.SC_ROUTE_WIDTH 7 \
  CONFIG.S_LATENCY 1 \
  CONFIG.USER_WIDTH 0 \
] [get_bd_cells m02_ar_node]
create_bd_cell -type ip -vlnv xilinx.com:ip:sc_node:1.0 m02_r_node
set_property -dict [list \
  CONFIG.ACLK_RELATIONSHIP 0 \
  CONFIG.ADDR_WIDTH 64 \
  CONFIG.CHANNEL 0 \
  CONFIG.ID_WIDTH 2 \
  CONFIG.M00_NUM_BYTES 64 \
  CONFIG.M01_NUM_BYTES 64 \
  CONFIG.M02_NUM_BYTES 64 \
  CONFIG.M03_NUM_BYTES 64 \
  CONFIG.M04_NUM_BYTES 64 \
  CONFIG.M05_NUM_BYTES 64 \
  CONFIG.M06_NUM_BYTES 64 \
  CONFIG.M07_NUM_BYTES 64 \
  CONFIG.M08_NUM_BYTES 64 \
  CONFIG.M09_NUM_BYTES 64 \
  CONFIG.M10_NUM_BYTES 64 \
  CONFIG.M11_NUM_BYTES 64 \
  CONFIG.M12_NUM_BYTES 64 \
  CONFIG.M13_NUM_BYTES 64 \
  CONFIG.M14_NUM_BYTES 64 \
  CONFIG.M15_NUM_BYTES 64 \
  CONFIG.MAX_PAYLD_BYTES 64 \
  CONFIG.M_PIPELINE 0 \
  CONFIG.NUM_MI 2 \
  CONFIG.NUM_OUTSTANDING 8 \
  CONFIG.NUM_SI 1 \
  CONFIG.PAYLD_WIDTH 533 \
  CONFIG.S00_NUM_BYTES 4 \
  CONFIG.S01_NUM_BYTES 4 \
  CONFIG.S02_NUM_BYTES 4 \
  CONFIG.S03_NUM_BYTES 4 \
  CONFIG.S04_NUM_BYTES 4 \
  CONFIG.S05_NUM_BYTES 4 \
  CONFIG.S06_NUM_BYTES 4 \
  CONFIG.S07_NUM_BYTES 4 \
  CONFIG.S08_NUM_BYTES 4 \
  CONFIG.S09_NUM_BYTES 4 \
  CONFIG.S10_NUM_BYTES 4 \
  CONFIG.S11_NUM_BYTES 4 \
  CONFIG.S12_NUM_BYTES 4 \
  CONFIG.S13_NUM_BYTES 4 \
  CONFIG.S14_NUM_BYTES 4 \
  CONFIG.S15_NUM_BYTES 4 \
  CONFIG.SC_ROUTE_WIDTH 2 \
  CONFIG.USER_BITS_PER_BYTE 0 \
  CONFIG.USER_WIDTH 0 \
] [get_bd_cells m02_r_node]
create_bd_cell -type ip -vlnv xilinx.com:ip:sc_node:1.0 m02_aw_node
set_property -dict [list \
  CONFIG.ACLK_RELATIONSHIP 0 \
  CONFIG.ADDR_WIDTH 64 \
  CONFIG.CHANNEL 3 \
  CONFIG.ID_WIDTH 2 \
  CONFIG.M00_NUM_BYTES 4 \
  CONFIG.M01_NUM_BYTES 4 \
  CONFIG.M02_NUM_BYTES 4 \
  CONFIG.M03_NUM_BYTES 4 \
  CONFIG.M04_NUM_BYTES 4 \
  CONFIG.M05_NUM_BYTES 4 \
  CONFIG.M06_NUM_BYTES 4 \
  CONFIG.M07_NUM_BYTES 4 \
  CONFIG.M08_NUM_BYTES 4 \
  CONFIG.M09_NUM_BYTES 4 \
  CONFIG.M10_NUM_BYTES 4 \
  CONFIG.M11_NUM_BYTES 4 \
  CONFIG.M12_NUM_BYTES 4 \
  CONFIG.M13_NUM_BYTES 4 \
  CONFIG.M14_NUM_BYTES 4 \
  CONFIG.M15_NUM_BYTES 4 \
  CONFIG.MAX_PAYLD_BYTES 64 \
  CONFIG.M_SEND_PIPELINE 0 \
  CONFIG.NUM_MI 1 \
  CONFIG.NUM_OUTSTANDING 32 \
  CONFIG.NUM_SI 2 \
  CONFIG.PAYLD_WIDTH 178 \
  CONFIG.S00_NUM_BYTES 64 \
  CONFIG.S01_NUM_BYTES 64 \
  CONFIG.S02_NUM_BYTES 64 \
  CONFIG.S03_NUM_BYTES 64 \
  CONFIG.S04_NUM_BYTES 64 \
  CONFIG.S05_NUM_BYTES 64 \
  CONFIG.S06_NUM_BYTES 64 \
  CONFIG.S07_NUM_BYTES 64 \
  CONFIG.S08_NUM_BYTES 64 \
  CONFIG.S09_NUM_BYTES 64 \
  CONFIG.S10_NUM_BYTES 64 \
  CONFIG.S11_NUM_BYTES 64 \
  CONFIG.S12_NUM_BYTES 64 \
  CONFIG.S13_NUM_BYTES 64 \
  CONFIG.S14_NUM_BYTES 64 \
  CONFIG.S15_NUM_BYTES 64 \
  CONFIG.SC_ROUTE_WIDTH 7 \
  CONFIG.S_LATENCY 1 \
  CONFIG.USER_WIDTH 0 \
] [get_bd_cells m02_aw_node]
create_bd_cell -type ip -vlnv xilinx.com:ip:sc_node:1.0 m02_w_node
set_property -dict [list \
  CONFIG.ACLK_RELATIONSHIP 0 \
  CONFIG.ADDR_WIDTH 64 \
  CONFIG.CHANNEL 1 \
  CONFIG.ID_WIDTH 2 \
  CONFIG.M00_NUM_BYTES 4 \
  CONFIG.M01_NUM_BYTES 4 \
  CONFIG.M02_NUM_BYTES 4 \
  CONFIG.M03_NUM_BYTES 4 \
  CONFIG.M04_NUM_BYTES 4 \
  CONFIG.M05_NUM_BYTES 4 \
  CONFIG.M06_NUM_BYTES 4 \
  CONFIG.M07_NUM_BYTES 4 \
  CONFIG.M08_NUM_BYTES 4 \
  CONFIG.M09_NUM_BYTES 4 \
  CONFIG.M10_NUM_BYTES 4 \
  CONFIG.M11_NUM_BYTES 4 \
  CONFIG.M12_NUM_BYTES 4 \
  CONFIG.M13_NUM_BYTES 4 \
  CONFIG.M14_NUM_BYTES 4 \
  CONFIG.M15_NUM_BYTES 4 \
  CONFIG.MAX_PAYLD_BYTES 64 \
  CONFIG.M_SEND_PIPELINE 0 \
  CONFIG.NUM_MI 1 \
  CONFIG.NUM_OUTSTANDING 32 \
  CONFIG.NUM_SI 2 \
  CONFIG.PAYLD_WIDTH 598 \
  CONFIG.S00_NUM_BYTES 64 \
  CONFIG.S01_NUM_BYTES 64 \
  CONFIG.S02_NUM_BYTES 64 \
  CONFIG.S03_NUM_BYTES 64 \
  CONFIG.S04_NUM_BYTES 64 \
  CONFIG.S05_NUM_BYTES 64 \
  CONFIG.S06_NUM_BYTES 64 \
  CONFIG.S07_NUM_BYTES 64 \
  CONFIG.S08_NUM_BYTES 64 \
  CONFIG.S09_NUM_BYTES 64 \
  CONFIG.S10_NUM_BYTES 64 \
  CONFIG.S11_NUM_BYTES 64 \
  CONFIG.S12_NUM_BYTES 64 \
  CONFIG.S13_NUM_BYTES 64 \
  CONFIG.S14_NUM_BYTES 64 \
  CONFIG.S15_NUM_BYTES 64 \
  CONFIG.SC_ROUTE_WIDTH 7 \
  CONFIG.S_LATENCY 1 \
  CONFIG.USER_BITS_PER_BYTE 0 \
  CONFIG.USER_WIDTH 0 \
] [get_bd_cells m02_w_node]
create_bd_cell -type ip -vlnv xilinx.com:ip:sc_node:1.0 m02_b_node
set_property -dict [list \
  CONFIG.ACLK_RELATIONSHIP 0 \
  CONFIG.ADDR_WIDTH 64 \
  CONFIG.CHANNEL 4 \
  CONFIG.ID_WIDTH 2 \
  CONFIG.M00_NUM_BYTES 64 \
  CONFIG.M01_NUM_BYTES 64 \
  CONFIG.M02_NUM_BYTES 64 \
  CONFIG.M03_NUM_BYTES 64 \
  CONFIG.M04_NUM_BYTES 64 \
  CONFIG.M05_NUM_BYTES 64 \
  CONFIG.M06_NUM_BYTES 64 \
  CONFIG.M07_NUM_BYTES 64 \
  CONFIG.M08_NUM_BYTES 64 \
  CONFIG.M09_NUM_BYTES 64 \
  CONFIG.M10_NUM_BYTES 64 \
  CONFIG.M11_NUM_BYTES 64 \
  CONFIG.M12_NUM_BYTES 64 \
  CONFIG.M13_NUM_BYTES 64 \
  CONFIG.M14_NUM_BYTES 64 \
  CONFIG.M15_NUM_BYTES 64 \
  CONFIG.MAX_PAYLD_BYTES 64 \
  CONFIG.M_PIPELINE 0 \
  CONFIG.NUM_MI 2 \
  CONFIG.NUM_OUTSTANDING 32 \
  CONFIG.NUM_SI 1 \
  CONFIG.PAYLD_WIDTH 7 \
  CONFIG.S00_NUM_BYTES 4 \
  CONFIG.S01_NUM_BYTES 4 \
  CONFIG.S02_NUM_BYTES 4 \
  CONFIG.S03_NUM_BYTES 4 \
  CONFIG.S04_NUM_BYTES 4 \
  CONFIG.S05_NUM_BYTES 4 \
  CONFIG.S06_NUM_BYTES 4 \
  CONFIG.S07_NUM_BYTES 4 \
  CONFIG.S08_NUM_BYTES 4 \
  CONFIG.S09_NUM_BYTES 4 \
  CONFIG.S10_NUM_BYTES 4 \
  CONFIG.S11_NUM_BYTES 4 \
  CONFIG.S12_NUM_BYTES 4 \
  CONFIG.S13_NUM_BYTES 4 \
  CONFIG.S14_NUM_BYTES 4 \
  CONFIG.S15_NUM_BYTES 4 \
  CONFIG.SC_ROUTE_WIDTH 2 \
  CONFIG.USER_WIDTH 0 \
] [get_bd_cells m02_b_node]

# ---- hierarchy /m02_exit_pipeline ----
current_bd_instance /m02_exit_pipeline
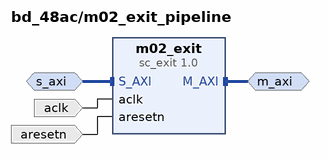
[diagram p12: block diagram inside /m02_exit_pipeline]
create_bd_intf_pin -mode Slave -vlnv xilinx.com:interface:aximm_rtl:1.0 s_axi
create_bd_intf_pin -mode Master -vlnv xilinx.com:interface:aximm_rtl:1.0 m_axi
create_bd_pin -dir I -type clk aclk
create_bd_pin -dir I -type rst aresetn

create_bd_cell -type ip -vlnv xilinx.com:ip:sc_exit:1.0 m02_exit
set_property -dict [list \
  CONFIG.ADDR_WIDTH 32 \
  CONFIG.HAS_BURST 0 \
  CONFIG.IS_CASCADED 0 \
  CONFIG.MEP_IDENTIFIER_WIDTH 2 \
  CONFIG.M_MAX_BURST_LENGTH 1 \
  CONFIG.M_PROTOCOL AXI4LITE \
  CONFIG.NUM_MSC 7 \
  CONFIG.NUM_READ_OUTSTANDING 8 \
  CONFIG.NUM_WRITE_OUTSTANDING 32 \
  CONFIG.RDATA_WIDTH 32 \
  CONFIG.READ_WRITE_MODE READ_WRITE \
  CONFIG.SSC000_ROUTE 0b00 \
  CONFIG.SSC001_ROUTE 0b01 \
  CONFIG.SSC002_ROUTE 0b10 \
  CONFIG.SSC003_ROUTE 0b00 \
  CONFIG.SSC_ROUTE_WIDTH 2 \
  CONFIG.S_ID_WIDTH 2 \
  CONFIG.WDATA_WIDTH 32 \
] [get_bd_cells m02_exit]

# ---- hierarchy /m03_nodes ----
current_bd_instance /m03_nodes
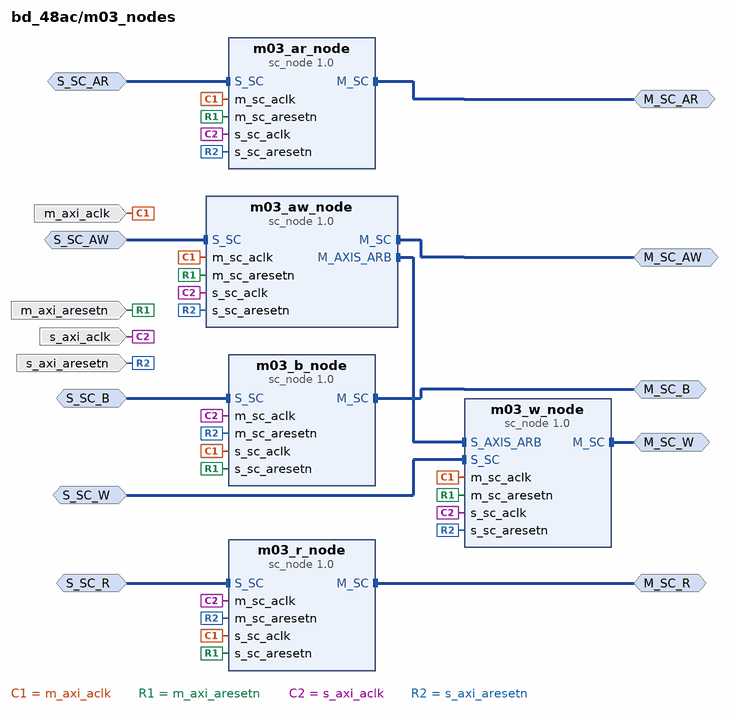
[diagram p13: block diagram inside /m03_nodes]
create_bd_intf_pin -mode Master -vlnv xilinx.com:interface:sc_rtl:1.0 M_SC_AR
create_bd_intf_pin -mode Slave -vlnv xilinx.com:interface:sc_rtl:1.0 S_SC_AR
create_bd_intf_pin -mode Master -vlnv xilinx.com:interface:sc_rtl:1.0 M_SC_R
create_bd_intf_pin -mode Slave -vlnv xilinx.com:interface:sc_rtl:1.0 S_SC_R
create_bd_intf_pin -mode Master -vlnv xilinx.com:interface:sc_rtl:1.0 M_SC_AW
create_bd_intf_pin -mode Slave -vlnv xilinx.com:interface:sc_rtl:1.0 S_SC_AW
create_bd_intf_pin -mode Master -vlnv xilinx.com:interface:sc_rtl:1.0 M_SC_W
create_bd_intf_pin -mode Slave -vlnv xilinx.com:interface:sc_rtl:1.0 S_SC_W
create_bd_intf_pin -mode Master -vlnv xilinx.com:interface:sc_rtl:1.0 M_SC_B
create_bd_intf_pin -mode Slave -vlnv xilinx.com:interface:sc_rtl:1.0 S_SC_B
create_bd_pin -dir I -type clk s_axi_aclk
create_bd_pin -dir I -type rst s_axi_aresetn
create_bd_pin -dir I -type clk m_axi_aclk
create_bd_pin -dir I -type rst m_axi_aresetn

create_bd_cell -type ip -vlnv xilinx.com:ip:sc_node:1.0 m03_ar_node
set_property -dict [list \
  CONFIG.ACLK_RELATIONSHIP 0 \
  CONFIG.ADDR_WIDTH 64 \
  CONFIG.CHANNEL 2 \
  CONFIG.ID_WIDTH 2 \
  CONFIG.M00_NUM_BYTES 4 \
  CONFIG.M01_NUM_BYTES 4 \
  CONFIG.M02_NUM_BYTES 4 \
  CONFIG.M03_NUM_BYTES 4 \
  CONFIG.M04_NUM_BYTES 4 \
  CONFIG.M05_NUM_BYTES 4 \
  CONFIG.M06_NUM_BYTES 4 \
  CONFIG.M07_NUM_BYTES 4 \
  CONFIG.M08_NUM_BYTES 4 \
  CONFIG.M09_NUM_BYTES 4 \
  CONFIG.M10_NUM_BYTES 4 \
  CONFIG.M11_NUM_BYTES 4 \
  CONFIG.M12_NUM_BYTES 4 \
  CONFIG.M13_NUM_BYTES 4 \
  CONFIG.M14_NUM_BYTES 4 \
  CONFIG.M15_NUM_BYTES 4 \
  CONFIG.MAX_PAYLD_BYTES 64 \
  CONFIG.M_SEND_PIPELINE 0 \
  CONFIG.NUM_MI 1 \
  CONFIG.NUM_OUTSTANDING 8 \
  CONFIG.NUM_SI 2 \
  CONFIG.PAYLD_WIDTH 178 \
  CONFIG.S00_NUM_BYTES 64 \
  CONFIG.S01_NUM_BYTES 64 \
  CONFIG.S02_NUM_BYTES 64 \
  CONFIG.S03_NUM_BYTES 64 \
  CONFIG.S04_NUM_BYTES 64 \
  CONFIG.S05_NUM_BYTES 64 \
  CONFIG.S06_NUM_BYTES 64 \
  CONFIG.S07_NUM_BYTES 64 \
  CONFIG.S08_NUM_BYTES 64 \
  CONFIG.S09_NUM_BYTES 64 \
  CONFIG.S10_NUM_BYTES 64 \
  CONFIG.S11_NUM_BYTES 64 \
  CONFIG.S12_NUM_BYTES 64 \
  CONFIG.S13_NUM_BYTES 64 \
  CONFIG.S14_NUM_BYTES 64 \
  CONFIG.S15_NUM_BYTES 64 \
  CONFIG.SC_ROUTE_WIDTH 7 \
  CONFIG.S_LATENCY 1 \
  CONFIG.USER_WIDTH 0 \
] [get_bd_cells m03_ar_node]
create_bd_cell -type ip -vlnv xilinx.com:ip:sc_node:1.0 m03_r_node
set_property -dict [list \
  CONFIG.ACLK_RELATIONSHIP 0 \
  CONFIG.ADDR_WIDTH 64 \
  CONFIG.CHANNEL 0 \
  CONFIG.ID_WIDTH 2 \
  CONFIG.M00_NUM_BYTES 64 \
  CONFIG.M01_NUM_BYTES 64 \
  CONFIG.M02_NUM_BYTES 64 \
  CONFIG.M03_NUM_BYTES 64 \
  CONFIG.M04_NUM_BYTES 64 \
  CONFIG.M05_NUM_BYTES 64 \
  CONFIG.M06_NUM_BYTES 64 \
  CONFIG.M07_NUM_BYTES 64 \
  CONFIG.M08_NUM_BYTES 64 \
  CONFIG.M09_NUM_BYTES 64 \
  CONFIG.M10_NUM_BYTES 64 \
  CONFIG.M11_NUM_BYTES 64 \
  CONFIG.M12_NUM_BYTES 64 \
  CONFIG.M13_NUM_BYTES 64 \
  CONFIG.M14_NUM_BYTES 64 \
  CONFIG.M15_NUM_BYTES 64 \
  CONFIG.MAX_PAYLD_BYTES 64 \
  CONFIG.M_PIPELINE 0 \
  CONFIG.NUM_MI 2 \
  CONFIG.NUM_OUTSTANDING 8 \
  CONFIG.NUM_SI 1 \
  CONFIG.PAYLD_WIDTH 533 \
  CONFIG.S00_NUM_BYTES 4 \
  CONFIG.S01_NUM_BYTES 4 \
  CONFIG.S02_NUM_BYTES 4 \
  CONFIG.S03_NUM_BYTES 4 \
  CONFIG.S04_NUM_BYTES 4 \
  CONFIG.S05_NUM_BYTES 4 \
  CONFIG.S06_NUM_BYTES 4 \
  CONFIG.S07_NUM_BYTES 4 \
  CONFIG.S08_NUM_BYTES 4 \
  CONFIG.S09_NUM_BYTES 4 \
  CONFIG.S10_NUM_BYTES 4 \
  CONFIG.S11_NUM_BYTES 4 \
  CONFIG.S12_NUM_BYTES 4 \
  CONFIG.S13_NUM_BYTES 4 \
  CONFIG.S14_NUM_BYTES 4 \
  CONFIG.S15_NUM_BYTES 4 \
  CONFIG.SC_ROUTE_WIDTH 2 \
  CONFIG.USER_BITS_PER_BYTE 0 \
  CONFIG.USER_WIDTH 0 \
] [get_bd_cells m03_r_node]
create_bd_cell -type ip -vlnv xilinx.com:ip:sc_node:1.0 m03_aw_node
set_property -dict [list \
  CONFIG.ACLK_RELATIONSHIP 0 \
  CONFIG.ADDR_WIDTH 64 \
  CONFIG.CHANNEL 3 \
  CONFIG.ID_WIDTH 2 \
  CONFIG.M00_NUM_BYTES 4 \
  CONFIG.M01_NUM_BYTES 4 \
  CONFIG.M02_NUM_BYTES 4 \
  CONFIG.M03_NUM_BYTES 4 \
  CONFIG.M04_NUM_BYTES 4 \
  CONFIG.M05_NUM_BYTES 4 \
  CONFIG.M06_NUM_BYTES 4 \
  CONFIG.M07_NUM_BYTES 4 \
  CONFIG.M08_NUM_BYTES 4 \
  CONFIG.M09_NUM_BYTES 4 \
  CONFIG.M10_NUM_BYTES 4 \
  CONFIG.M11_NUM_BYTES 4 \
  CONFIG.M12_NUM_BYTES 4 \
  CONFIG.M13_NUM_BYTES 4 \
  CONFIG.M14_NUM_BYTES 4 \
  CONFIG.M15_NUM_BYTES 4 \
  CONFIG.MAX_PAYLD_BYTES 64 \
  CONFIG.M_SEND_PIPELINE 0 \
  CONFIG.NUM_MI 1 \
  CONFIG.NUM_OUTSTANDING 32 \
  CONFIG.NUM_SI 2 \
  CONFIG.PAYLD_WIDTH 178 \
  CONFIG.S00_NUM_BYTES 64 \
  CONFIG.S01_NUM_BYTES 64 \
  CONFIG.S02_NUM_BYTES 64 \
  CONFIG.S03_NUM_BYTES 64 \
  CONFIG.S04_NUM_BYTES 64 \
  CONFIG.S05_NUM_BYTES 64 \
  CONFIG.S06_NUM_BYTES 64 \
  CONFIG.S07_NUM_BYTES 64 \
  CONFIG.S08_NUM_BYTES 64 \
  CONFIG.S09_NUM_BYTES 64 \
  CONFIG.S10_NUM_BYTES 64 \
  CONFIG.S11_NUM_BYTES 64 \
  CONFIG.S12_NUM_BYTES 64 \
  CONFIG.S13_NUM_BYTES 64 \
  CONFIG.S14_NUM_BYTES 64 \
  CONFIG.S15_NUM_BYTES 64 \
  CONFIG.SC_ROUTE_WIDTH 7 \
  CONFIG.S_LATENCY 1 \
  CONFIG.USER_WIDTH 0 \
] [get_bd_cells m03_aw_node]
create_bd_cell -type ip -vlnv xilinx.com:ip:sc_node:1.0 m03_w_node
set_property -dict [list \
  CONFIG.ACLK_RELATIONSHIP 0 \
  CONFIG.ADDR_WIDTH 64 \
  CONFIG.CHANNEL 1 \
  CONFIG.ID_WIDTH 2 \
  CONFIG.M00_NUM_BYTES 4 \
  CONFIG.M01_NUM_BYTES 4 \
  CONFIG.M02_NUM_BYTES 4 \
  CONFIG.M03_NUM_BYTES 4 \
  CONFIG.M04_NUM_BYTES 4 \
  CONFIG.M05_NUM_BYTES 4 \
  CONFIG.M06_NUM_BYTES 4 \
  CONFIG.M07_NUM_BYTES 4 \
  CONFIG.M08_NUM_BYTES 4 \
  CONFIG.M09_NUM_BYTES 4 \
  CONFIG.M10_NUM_BYTES 4 \
  CONFIG.M11_NUM_BYTES 4 \
  CONFIG.M12_NUM_BYTES 4 \
  CONFIG.M13_NUM_BYTES 4 \
  CONFIG.M14_NUM_BYTES 4 \
  CONFIG.M15_NUM_BYTES 4 \
  CONFIG.MAX_PAYLD_BYTES 64 \
  CONFIG.M_SEND_PIPELINE 0 \
  CONFIG.NUM_MI 1 \
  CONFIG.NUM_OUTSTANDING 32 \
  CONFIG.NUM_SI 2 \
  CONFIG.PAYLD_WIDTH 598 \
  CONFIG.S00_NUM_BYTES 64 \
  CONFIG.S01_NUM_BYTES 64 \
  CONFIG.S02_NUM_BYTES 64 \
  CONFIG.S03_NUM_BYTES 64 \
  CONFIG.S04_NUM_BYTES 64 \
  CONFIG.S05_NUM_BYTES 64 \
  CONFIG.S06_NUM_BYTES 64 \
  CONFIG.S07_NUM_BYTES 64 \
  CONFIG.S08_NUM_BYTES 64 \
  CONFIG.S09_NUM_BYTES 64 \
  CONFIG.S10_NUM_BYTES 64 \
  CONFIG.S11_NUM_BYTES 64 \
  CONFIG.S12_NUM_BYTES 64 \
  CONFIG.S13_NUM_BYTES 64 \
  CONFIG.S14_NUM_BYTES 64 \
  CONFIG.S15_NUM_BYTES 64 \
  CONFIG.SC_ROUTE_WIDTH 7 \
  CONFIG.S_LATENCY 1 \
  CONFIG.USER_BITS_PER_BYTE 0 \
  CONFIG.USER_WIDTH 0 \
] [get_bd_cells m03_w_node]
create_bd_cell -type ip -vlnv xilinx.com:ip:sc_node:1.0 m03_b_node
set_property -dict [list \
  CONFIG.ACLK_RELATIONSHIP 0 \
  CONFIG.ADDR_WIDTH 64 \
  CONFIG.CHANNEL 4 \
  CONFIG.ID_WIDTH 2 \
  CONFIG.M00_NUM_BYTES 64 \
  CONFIG.M01_NUM_BYTES 64 \
  CONFIG.M02_NUM_BYTES 64 \
  CONFIG.M03_NUM_BYTES 64 \
  CONFIG.M04_NUM_BYTES 64 \
  CONFIG.M05_NUM_BYTES 64 \
  CONFIG.M06_NUM_BYTES 64 \
  CONFIG.M07_NUM_BYTES 64 \
  CONFIG.M08_NUM_BYTES 64 \
  CONFIG.M09_NUM_BYTES 64 \
  CONFIG.M10_NUM_BYTES 64 \
  CONFIG.M11_NUM_BYTES 64 \
  CONFIG.M12_NUM_BYTES 64 \
  CONFIG.M13_NUM_BYTES 64 \
  CONFIG.M14_NUM_BYTES 64 \
  CONFIG.M15_NUM_BYTES 64 \
  CONFIG.MAX_PAYLD_BYTES 64 \
  CONFIG.M_PIPELINE 0 \
  CONFIG.NUM_MI 2 \
  CONFIG.NUM_OUTSTANDING 32 \
  CONFIG.NUM_SI 1 \
  CONFIG.PAYLD_WIDTH 7 \
  CONFIG.S00_NUM_BYTES 4 \
  CONFIG.S01_NUM_BYTES 4 \
  CONFIG.S02_NUM_BYTES 4 \
  CONFIG.S03_NUM_BYTES 4 \
  CONFIG.S04_NUM_BYTES 4 \
  CONFIG.S05_NUM_BYTES 4 \
  CONFIG.S06_NUM_BYTES 4 \
  CONFIG.S07_NUM_BYTES 4 \
  CONFIG.S08_NUM_BYTES 4 \
  CONFIG.S09_NUM_BYTES 4 \
  CONFIG.S10_NUM_BYTES 4 \
  CONFIG.S11_NUM_BYTES 4 \
  CONFIG.S12_NUM_BYTES 4 \
  CONFIG.S13_NUM_BYTES 4 \
  CONFIG.S14_NUM_BYTES 4 \
  CONFIG.S15_NUM_BYTES 4 \
  CONFIG.SC_ROUTE_WIDTH 2 \
  CONFIG.USER_WIDTH 0 \
] [get_bd_cells m03_b_node]

# ---- hierarchy /m03_exit_pipeline ----
current_bd_instance /m03_exit_pipeline
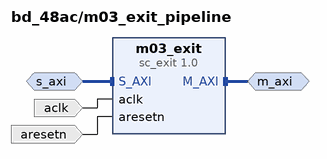
[diagram p14: block diagram inside /m03_exit_pipeline]
create_bd_intf_pin -mode Slave -vlnv xilinx.com:interface:aximm_rtl:1.0 s_axi
create_bd_intf_pin -mode Master -vlnv xilinx.com:interface:aximm_rtl:1.0 m_axi
create_bd_pin -dir I -type clk aclk
create_bd_pin -dir I -type rst aresetn

create_bd_cell -type ip -vlnv xilinx.com:ip:sc_exit:1.0 m03_exit
set_property -dict [list \
  CONFIG.ADDR_WIDTH 6 \
  CONFIG.HAS_BURST 0 \
  CONFIG.IS_CASCADED 0 \
  CONFIG.MEP_IDENTIFIER_WIDTH 2 \
  CONFIG.M_MAX_BURST_LENGTH 1 \
  CONFIG.M_PROTOCOL AXI4LITE \
  CONFIG.NUM_MSC 7 \
  CONFIG.NUM_READ_OUTSTANDING 8 \
  CONFIG.NUM_WRITE_OUTSTANDING 32 \
  CONFIG.RDATA_WIDTH 32 \
  CONFIG.READ_WRITE_MODE READ_WRITE \
  CONFIG.SSC000_ROUTE 0b00 \
  CONFIG.SSC001_ROUTE 0b01 \
  CONFIG.SSC002_ROUTE 0b10 \
  CONFIG.SSC003_ROUTE 0b00 \
  CONFIG.SSC_ROUTE_WIDTH 2 \
  CONFIG.S_ID_WIDTH 2 \
  CONFIG.WDATA_WIDTH 32 \
] [get_bd_cells m03_exit]

# ---- hierarchy /m04_nodes ----
current_bd_instance /m04_nodes
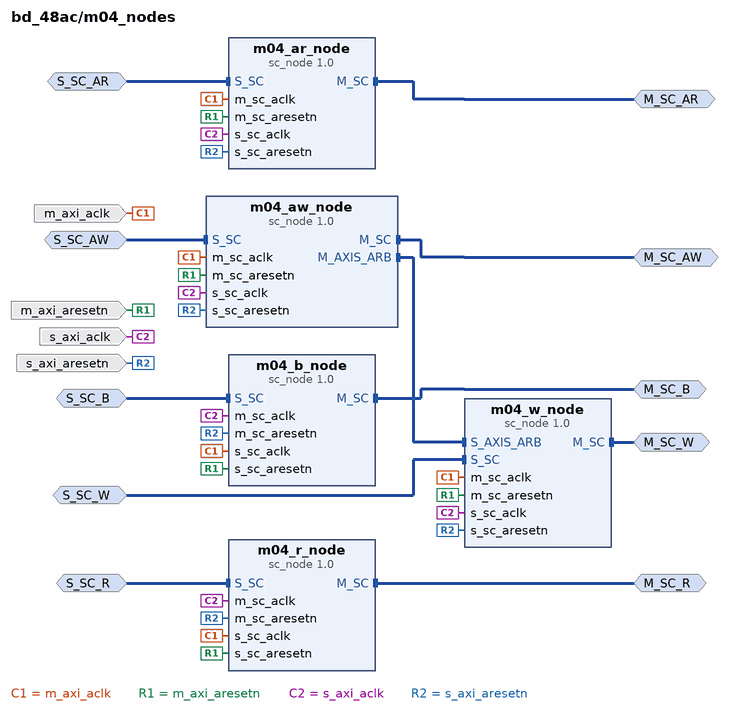
[diagram p15: block diagram inside /m04_nodes]
create_bd_intf_pin -mode Master -vlnv xilinx.com:interface:sc_rtl:1.0 M_SC_AR
create_bd_intf_pin -mode Slave -vlnv xilinx.com:interface:sc_rtl:1.0 S_SC_AR
create_bd_intf_pin -mode Master -vlnv xilinx.com:interface:sc_rtl:1.0 M_SC_R
create_bd_intf_pin -mode Slave -vlnv xilinx.com:interface:sc_rtl:1.0 S_SC_R
create_bd_intf_pin -mode Master -vlnv xilinx.com:interface:sc_rtl:1.0 M_SC_AW
create_bd_intf_pin -mode Slave -vlnv xilinx.com:interface:sc_rtl:1.0 S_SC_AW
create_bd_intf_pin -mode Master -vlnv xilinx.com:interface:sc_rtl:1.0 M_SC_W
create_bd_intf_pin -mode Slave -vlnv xilinx.com:interface:sc_rtl:1.0 S_SC_W
create_bd_intf_pin -mode Master -vlnv xilinx.com:interface:sc_rtl:1.0 M_SC_B
create_bd_intf_pin -mode Slave -vlnv xilinx.com:interface:sc_rtl:1.0 S_SC_B
create_bd_pin -dir I -type clk s_axi_aclk
create_bd_pin -dir I -type rst s_axi_aresetn
create_bd_pin -dir I -type clk m_axi_aclk
create_bd_pin -dir I -type rst m_axi_aresetn

create_bd_cell -type ip -vlnv xilinx.com:ip:sc_node:1.0 m04_ar_node
set_property -dict [list \
  CONFIG.ACLK_RELATIONSHIP 0 \
  CONFIG.ADDR_WIDTH 64 \
  CONFIG.CHANNEL 2 \
  CONFIG.ID_WIDTH 2 \
  CONFIG.M00_NUM_BYTES 4 \
  CONFIG.M01_NUM_BYTES 4 \
  CONFIG.M02_NUM_BYTES 4 \
  CONFIG.M03_NUM_BYTES 4 \
  CONFIG.M04_NUM_BYTES 4 \
  CONFIG.M05_NUM_BYTES 4 \
  CONFIG.M06_NUM_BYTES 4 \
  CONFIG.M07_NUM_BYTES 4 \
  CONFIG.M08_NUM_BYTES 4 \
  CONFIG.M09_NUM_BYTES 4 \
  CONFIG.M10_NUM_BYTES 4 \
  CONFIG.M11_NUM_BYTES 4 \
  CONFIG.M12_NUM_BYTES 4 \
  CONFIG.M13_NUM_BYTES 4 \
  CONFIG.M14_NUM_BYTES 4 \
  CONFIG.M15_NUM_BYTES 4 \
  CONFIG.MAX_PAYLD_BYTES 64 \
  CONFIG.M_SEND_PIPELINE 0 \
  CONFIG.NUM_MI 1 \
  CONFIG.NUM_OUTSTANDING 8 \
  CONFIG.NUM_SI 2 \
  CONFIG.PAYLD_WIDTH 178 \
  CONFIG.S00_NUM_BYTES 64 \
  CONFIG.S01_NUM_BYTES 64 \
  CONFIG.S02_NUM_BYTES 64 \
  CONFIG.S03_NUM_BYTES 64 \
  CONFIG.S04_NUM_BYTES 64 \
  CONFIG.S05_NUM_BYTES 64 \
  CONFIG.S06_NUM_BYTES 64 \
  CONFIG.S07_NUM_BYTES 64 \
  CONFIG.S08_NUM_BYTES 64 \
  CONFIG.S09_NUM_BYTES 64 \
  CONFIG.S10_NUM_BYTES 64 \
  CONFIG.S11_NUM_BYTES 64 \
  CONFIG.S12_NUM_BYTES 64 \
  CONFIG.S13_NUM_BYTES 64 \
  CONFIG.S14_NUM_BYTES 64 \
  CONFIG.S15_NUM_BYTES 64 \
  CONFIG.SC_ROUTE_WIDTH 7 \
  CONFIG.S_LATENCY 1 \
  CONFIG.USER_WIDTH 0 \
] [get_bd_cells m04_ar_node]
create_bd_cell -type ip -vlnv xilinx.com:ip:sc_node:1.0 m04_r_node
set_property -dict [list \
  CONFIG.ACLK_RELATIONSHIP 0 \
  CONFIG.ADDR_WIDTH 64 \
  CONFIG.CHANNEL 0 \
  CONFIG.ID_WIDTH 2 \
  CONFIG.M00_NUM_BYTES 64 \
  CONFIG.M01_NUM_BYTES 64 \
  CONFIG.M02_NUM_BYTES 64 \
  CONFIG.M03_NUM_BYTES 64 \
  CONFIG.M04_NUM_BYTES 64 \
  CONFIG.M05_NUM_BYTES 64 \
  CONFIG.M06_NUM_BYTES 64 \
  CONFIG.M07_NUM_BYTES 64 \
  CONFIG.M08_NUM_BYTES 64 \
  CONFIG.M09_NUM_BYTES 64 \
  CONFIG.M10_NUM_BYTES 64 \
  CONFIG.M11_NUM_BYTES 64 \
  CONFIG.M12_NUM_BYTES 64 \
  CONFIG.M13_NUM_BYTES 64 \
  CONFIG.M14_NUM_BYTES 64 \
  CONFIG.M15_NUM_BYTES 64 \
  CONFIG.MAX_PAYLD_BYTES 64 \
  CONFIG.M_PIPELINE 0 \
  CONFIG.NUM_MI 2 \
  CONFIG.NUM_OUTSTANDING 8 \
  CONFIG.NUM_SI 1 \
  CONFIG.PAYLD_WIDTH 533 \
  CONFIG.S00_NUM_BYTES 4 \
  CONFIG.S01_NUM_BYTES 4 \
  CONFIG.S02_NUM_BYTES 4 \
  CONFIG.S03_NUM_BYTES 4 \
  CONFIG.S04_NUM_BYTES 4 \
  CONFIG.S05_NUM_BYTES 4 \
  CONFIG.S06_NUM_BYTES 4 \
  CONFIG.S07_NUM_BYTES 4 \
  CONFIG.S08_NUM_BYTES 4 \
  CONFIG.S09_NUM_BYTES 4 \
  CONFIG.S10_NUM_BYTES 4 \
  CONFIG.S11_NUM_BYTES 4 \
  CONFIG.S12_NUM_BYTES 4 \
  CONFIG.S13_NUM_BYTES 4 \
  CONFIG.S14_NUM_BYTES 4 \
  CONFIG.S15_NUM_BYTES 4 \
  CONFIG.SC_ROUTE_WIDTH 2 \
  CONFIG.USER_BITS_PER_BYTE 0 \
  CONFIG.USER_WIDTH 0 \
] [get_bd_cells m04_r_node]
create_bd_cell -type ip -vlnv xilinx.com:ip:sc_node:1.0 m04_aw_node
set_property -dict [list \
  CONFIG.ACLK_RELATIONSHIP 0 \
  CONFIG.ADDR_WIDTH 64 \
  CONFIG.CHANNEL 3 \
  CONFIG.ID_WIDTH 2 \
  CONFIG.M00_NUM_BYTES 4 \
  CONFIG.M01_NUM_BYTES 4 \
  CONFIG.M02_NUM_BYTES 4 \
  CONFIG.M03_NUM_BYTES 4 \
  CONFIG.M04_NUM_BYTES 4 \
  CONFIG.M05_NUM_BYTES 4 \
  CONFIG.M06_NUM_BYTES 4 \
  CONFIG.M07_NUM_BYTES 4 \
  CONFIG.M08_NUM_BYTES 4 \
  CONFIG.M09_NUM_BYTES 4 \
  CONFIG.M10_NUM_BYTES 4 \
  CONFIG.M11_NUM_BYTES 4 \
  CONFIG.M12_NUM_BYTES 4 \
  CONFIG.M13_NUM_BYTES 4 \
  CONFIG.M14_NUM_BYTES 4 \
  CONFIG.M15_NUM_BYTES 4 \
  CONFIG.MAX_PAYLD_BYTES 64 \
  CONFIG.M_SEND_PIPELINE 0 \
  CONFIG.NUM_MI 1 \
  CONFIG.NUM_OUTSTANDING 32 \
  CONFIG.NUM_SI 2 \
  CONFIG.PAYLD_WIDTH 178 \
  CONFIG.S00_NUM_BYTES 64 \
  CONFIG.S01_NUM_BYTES 64 \
  CONFIG.S02_NUM_BYTES 64 \
  CONFIG.S03_NUM_BYTES 64 \
  CONFIG.S04_NUM_BYTES 64 \
  CONFIG.S05_NUM_BYTES 64 \
  CONFIG.S06_NUM_BYTES 64 \
  CONFIG.S07_NUM_BYTES 64 \
  CONFIG.S08_NUM_BYTES 64 \
  CONFIG.S09_NUM_BYTES 64 \
  CONFIG.S10_NUM_BYTES 64 \
  CONFIG.S11_NUM_BYTES 64 \
  CONFIG.S12_NUM_BYTES 64 \
  CONFIG.S13_NUM_BYTES 64 \
  CONFIG.S14_NUM_BYTES 64 \
  CONFIG.S15_NUM_BYTES 64 \
  CONFIG.SC_ROUTE_WIDTH 7 \
  CONFIG.S_LATENCY 1 \
  CONFIG.USER_WIDTH 0 \
] [get_bd_cells m04_aw_node]
create_bd_cell -type ip -vlnv xilinx.com:ip:sc_node:1.0 m04_w_node
set_property -dict [list \
  CONFIG.ACLK_RELATIONSHIP 0 \
  CONFIG.ADDR_WIDTH 64 \
  CONFIG.CHANNEL 1 \
  CONFIG.ID_WIDTH 2 \
  CONFIG.M00_NUM_BYTES 4 \
  CONFIG.M01_NUM_BYTES 4 \
  CONFIG.M02_NUM_BYTES 4 \
  CONFIG.M03_NUM_BYTES 4 \
  CONFIG.M04_NUM_BYTES 4 \
  CONFIG.M05_NUM_BYTES 4 \
  CONFIG.M06_NUM_BYTES 4 \
  CONFIG.M07_NUM_BYTES 4 \
  CONFIG.M08_NUM_BYTES 4 \
  CONFIG.M09_NUM_BYTES 4 \
  CONFIG.M10_NUM_BYTES 4 \
  CONFIG.M11_NUM_BYTES 4 \
  CONFIG.M12_NUM_BYTES 4 \
  CONFIG.M13_NUM_BYTES 4 \
  CONFIG.M14_NUM_BYTES 4 \
  CONFIG.M15_NUM_BYTES 4 \
  CONFIG.MAX_PAYLD_BYTES 64 \
  CONFIG.M_SEND_PIPELINE 0 \
  CONFIG.NUM_MI 1 \
  CONFIG.NUM_OUTSTANDING 32 \
  CONFIG.NUM_SI 2 \
  CONFIG.PAYLD_WIDTH 598 \
  CONFIG.S00_NUM_BYTES 64 \
  CONFIG.S01_NUM_BYTES 64 \
  CONFIG.S02_NUM_BYTES 64 \
  CONFIG.S03_NUM_BYTES 64 \
  CONFIG.S04_NUM_BYTES 64 \
  CONFIG.S05_NUM_BYTES 64 \
  CONFIG.S06_NUM_BYTES 64 \
  CONFIG.S07_NUM_BYTES 64 \
  CONFIG.S08_NUM_BYTES 64 \
  CONFIG.S09_NUM_BYTES 64 \
  CONFIG.S10_NUM_BYTES 64 \
  CONFIG.S11_NUM_BYTES 64 \
  CONFIG.S12_NUM_BYTES 64 \
  CONFIG.S13_NUM_BYTES 64 \
  CONFIG.S14_NUM_BYTES 64 \
  CONFIG.S15_NUM_BYTES 64 \
  CONFIG.SC_ROUTE_WIDTH 7 \
  CONFIG.S_LATENCY 1 \
  CONFIG.USER_BITS_PER_BYTE 0 \
  CONFIG.USER_WIDTH 0 \
] [get_bd_cells m04_w_node]
create_bd_cell -type ip -vlnv xilinx.com:ip:sc_node:1.0 m04_b_node
set_property -dict [list \
  CONFIG.ACLK_RELATIONSHIP 0 \
  CONFIG.ADDR_WIDTH 64 \
  CONFIG.CHANNEL 4 \
  CONFIG.ID_WIDTH 2 \
  CONFIG.M00_NUM_BYTES 64 \
  CONFIG.M01_NUM_BYTES 64 \
  CONFIG.M02_NUM_BYTES 64 \
  CONFIG.M03_NUM_BYTES 64 \
  CONFIG.M04_NUM_BYTES 64 \
  CONFIG.M05_NUM_BYTES 64 \
  CONFIG.M06_NUM_BYTES 64 \
  CONFIG.M07_NUM_BYTES 64 \
  CONFIG.M08_NUM_BYTES 64 \
  CONFIG.M09_NUM_BYTES 64 \
  CONFIG.M10_NUM_BYTES 64 \
  CONFIG.M11_NUM_BYTES 64 \
  CONFIG.M12_NUM_BYTES 64 \
  CONFIG.M13_NUM_BYTES 64 \
  CONFIG.M14_NUM_BYTES 64 \
  CONFIG.M15_NUM_BYTES 64 \
  CONFIG.MAX_PAYLD_BYTES 64 \
  CONFIG.M_PIPELINE 0 \
  CONFIG.NUM_MI 2 \
  CONFIG.NUM_OUTSTANDING 32 \
  CONFIG.NUM_SI 1 \
  CONFIG.PAYLD_WIDTH 7 \
  CONFIG.S00_NUM_BYTES 4 \
  CONFIG.S01_NUM_BYTES 4 \
  CONFIG.S02_NUM_BYTES 4 \
  CONFIG.S03_NUM_BYTES 4 \
  CONFIG.S04_NUM_BYTES 4 \
  CONFIG.S05_NUM_BYTES 4 \
  CONFIG.S06_NUM_BYTES 4 \
  CONFIG.S07_NUM_BYTES 4 \
  CONFIG.S08_NUM_BYTES 4 \
  CONFIG.S09_NUM_BYTES 4 \
  CONFIG.S10_NUM_BYTES 4 \
  CONFIG.S11_NUM_BYTES 4 \
  CONFIG.S12_NUM_BYTES 4 \
  CONFIG.S13_NUM_BYTES 4 \
  CONFIG.S14_NUM_BYTES 4 \
  CONFIG.S15_NUM_BYTES 4 \
  CONFIG.SC_ROUTE_WIDTH 2 \
  CONFIG.USER_WIDTH 0 \
] [get_bd_cells m04_b_node]
